# Altium schematic sheet MicroDial_Data_Log_V2_Part2.SchDoc: MicroDial_Data_Log_V2
size A4; Author: Burak DURU; Organization: CNRS DT INSU UPS855; Address1: 1, place Aristide Briand; Address2: 92195 Meudon Cedex; Address3: Tel : 01 45 07 50 50; Address4: FRANCE; DocumentNumber: 2; Revision: 2.0; SheetNumber: 2; SheetTotal: 4
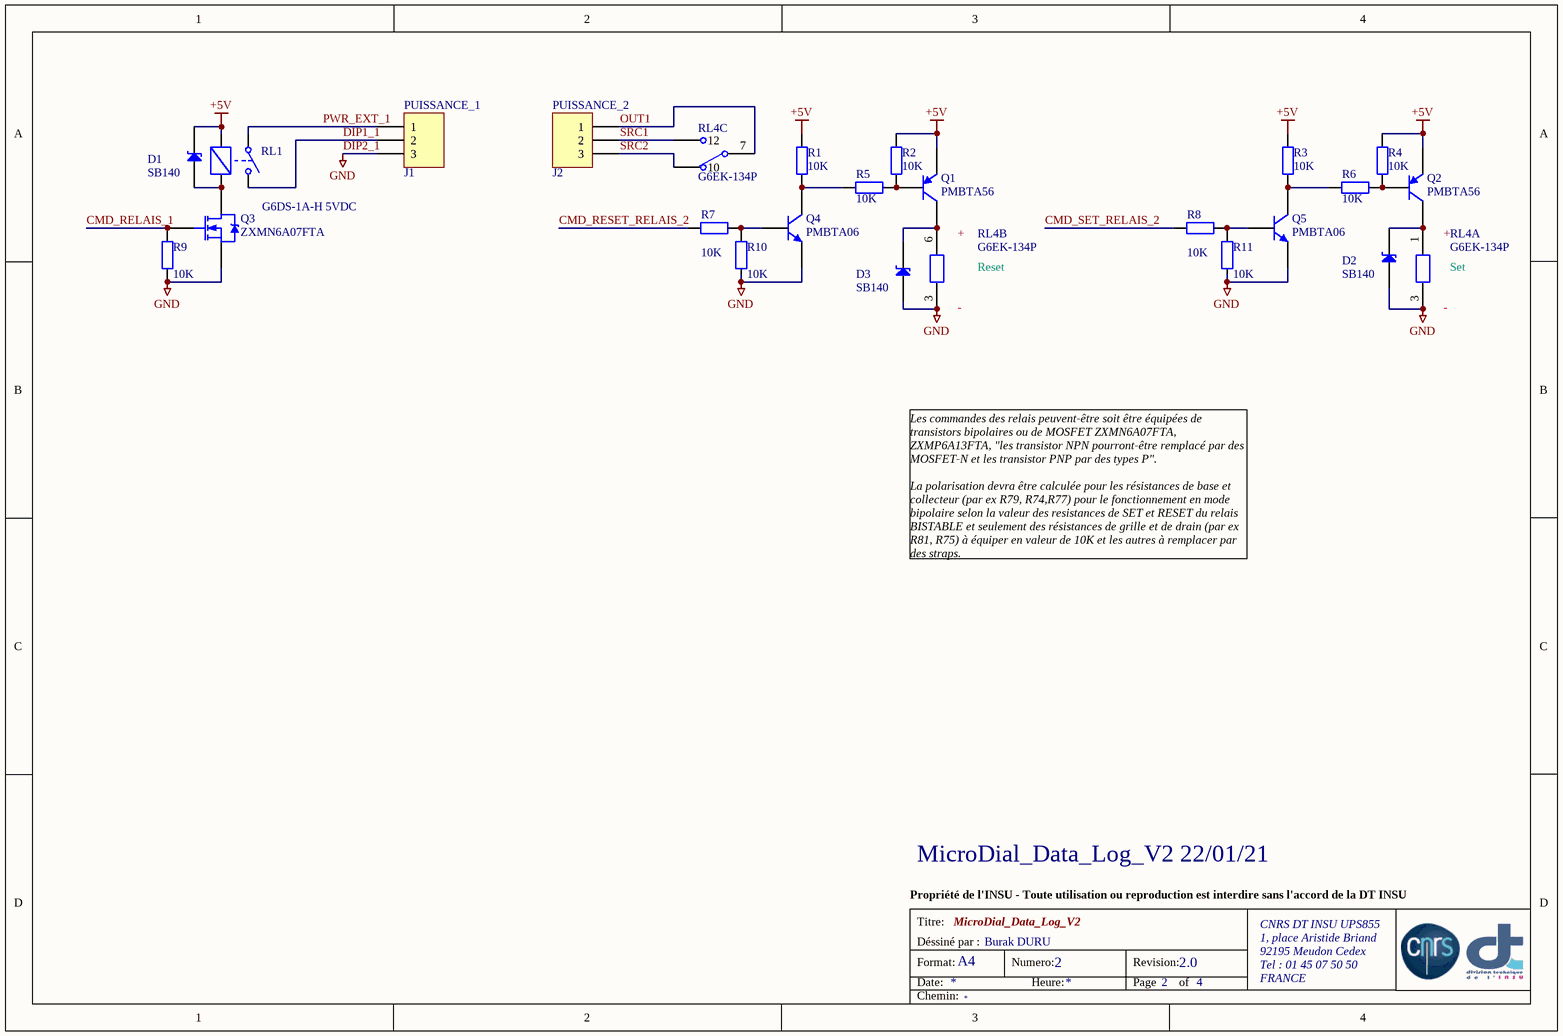
[diagram p0: MicroDial_Data_Log_V2_Part2.SchDoc]

## Parts
D1  SB140  [DO-41]
D2  SB140  [DO-41]
D3  SB140  [DO-41]
J1  PUISSANCE_1  [MKDS 1/3-3.81]
J2  PUISSANCE_2  [MKDS 1/3-3.81]
Q1  PMBTA56  [SOT-23A]
Q2  PMBTA56  [SOT-23A]
Q3  ZXMN6A07FTA  [SOT23 - NMOSFET]
Q4  PMBTA06  [SOT-23A]
Q5  PMBTA06  [SOT-23A]
R1  value 10K  [R603]  (hidden comment: Res)
R2  value 10K  [R603]  (hidden comment: Res)
R3  value 10K  [R603]  (hidden comment: Res)
R4  value 10K  [R603]  (hidden comment: Res)
R5  value 10K  [R603]  (hidden comment: Res)
R6  value 10K  [R603]  (hidden comment: Res)
R7  value 10K  [R603]  (hidden comment: Res)
R8  value 10K  [R603]  (hidden comment: Res)
R9  value 10K  [R603]  (hidden comment: Res)
R10  value 10K  [R603]  (hidden comment: Res)
R11  value 10K  [R603]  (hidden comment: Res)
RL1  G6DS-1A-H 5VDC  [G6DS-1A-H]
RL4  G6EK-134P  [G6EK-134P]  (parts A,B,C of 3)

## Nets
+5V: D1.2(K) Q1.2(E) Q2.2(E) R1.1 R2.1 R3.1 R4.1 RL1.16
DIP2_1: D2.1(A) D3.1(A) J1.3 Q3.3(S) Q4.2(E) Q5.2(E) R9.1 R10.1 R11.1 RL4.3  [also labelled GND]
CMD_RELAIS_1: Q3.1(G) R9.2
CMD_RESET_RELAIS_2: R7.2
CMD_SET_RELAIS_2: R8.2
DIP1_1: J1.2 RL1.6
OUT1: J2.1 RL4.7
PWR_EXT_1: J1.1 RL1.8
SRC1: J2.2 RL4.12
SRC2: J2.3 RL4.10
NetD1_1: D1.1(A) Q3.2(D) RL1.15
NetD2_2: D2.2(K) Q2.3(C) RL4.1
NetD3_2: D3.2(K) Q1.3(C) RL4.6
NetQ1_1: Q1.1(B) R2.2 R5.2
NetQ2_1: Q2.1(B) R4.2 R6.2
NetQ4_1: Q4.1(B) R7.1 R10.2
NetQ4_3: Q4.3(C) R1.2 R5.1
NetQ5_1: Q5.1(B) R8.1 R11.2
NetQ5_3: Q5.3(C) R3.2 R6.1

## Notes on the sheet
- Les commandes des relais peuvent-être soit être équipées de transistors bipolaires ou de MOSFET ZXMN6A07FTA, ZXMP6A13FTA, "les transistor NPN pourront-être remplacé par des MOSFET-N et les transistor PNP par des types P".
  La polarisation devra être calculée pour les résistances de base et collecteur (par ex R79, R74,R77) pour le fonctionnement en mode bipolaire selon la valeur des resistances de SET et RESET du relais BISTABLE et seulement des résistances de grille et de drain (par ex R81, R75) à équiper en valeur de 10K et les autres à remplacer par des straps.
- MicroDial_Data_Log_V2 22/01/21
- Propriété de l'INSU - Toute utilisation ou reproduction est interdire sans l'accord de la DT INSU
- Titre:
- Format:
- Date:
- Déssiné par :
- A4
- Numero:
- Heure:
- Revision:
- Page
- of
- Chemin:
- (in symbol G6EK-134P, part A) +; Set; -
- (in symbol G6EK-134P, part B) +; Reset; -

## Library data of the parts
D1-D3 = Diode_Schottky: SB140  Redresseur Schottky, 40 V, 1 A, Une, DO-41 (DO-204AL), 2 Broche(s), 500 mV; Code Commande: F146-7528; Value: SB140
J1 J2 = PHOENIX CONTACT MKDS 1/3-3.81: PHOENIX CONTACT MKDS 1/3-3.81  SR 3V DROIT; Value: PHOENIX CONTACT MKDS 1/ 3-3,81 - 1727023; Code Commande: F370-4580
Q1 Q2 = PMBTA56: PNP General Purpose Amplifier; Code Commande: Mouser 771-PMBTA56-T/R; Value: PMBTA56
Q3 = ZXMN6A07FTA: 60V N-Channel ENHANCEMENT MODE MOSFET; Code Commande: Mouser 522-ZXMN6A07FTA ou F952-5769; Value: ZXMN6A07FTA
Q4 Q5 = PMBTA06: NPN General Purpose Amplifier; Code Commande: MOUSER 771-PMBTA06-T/R; Value: PMBTA06
R1-R11 = Res: WF06P1002FTL Résistance à puce CMS, 10 kohm, ± 1%, 125 mW, 0603 [1608 Metric], Couche épaisse, Haute puissance; Code Commande: F250-2802
RL1 = G6DS-1A-H 5VDC: Relais 1RT Normalement Ouvert 5V 5A; Code Commande: RS613-2305; Value: G6D-1A-ASI 5VDC
RL4 = G6EK-134P: SPST RELAIS DOUBLE COIL; Value: G6EK-134P-ST-US-DC5; Code Commande: Mouser 653-G6EK-134P-DC5 / RS 683-9469